# Altium schematic sheet STM32_GPIO.SchDoc
size A4
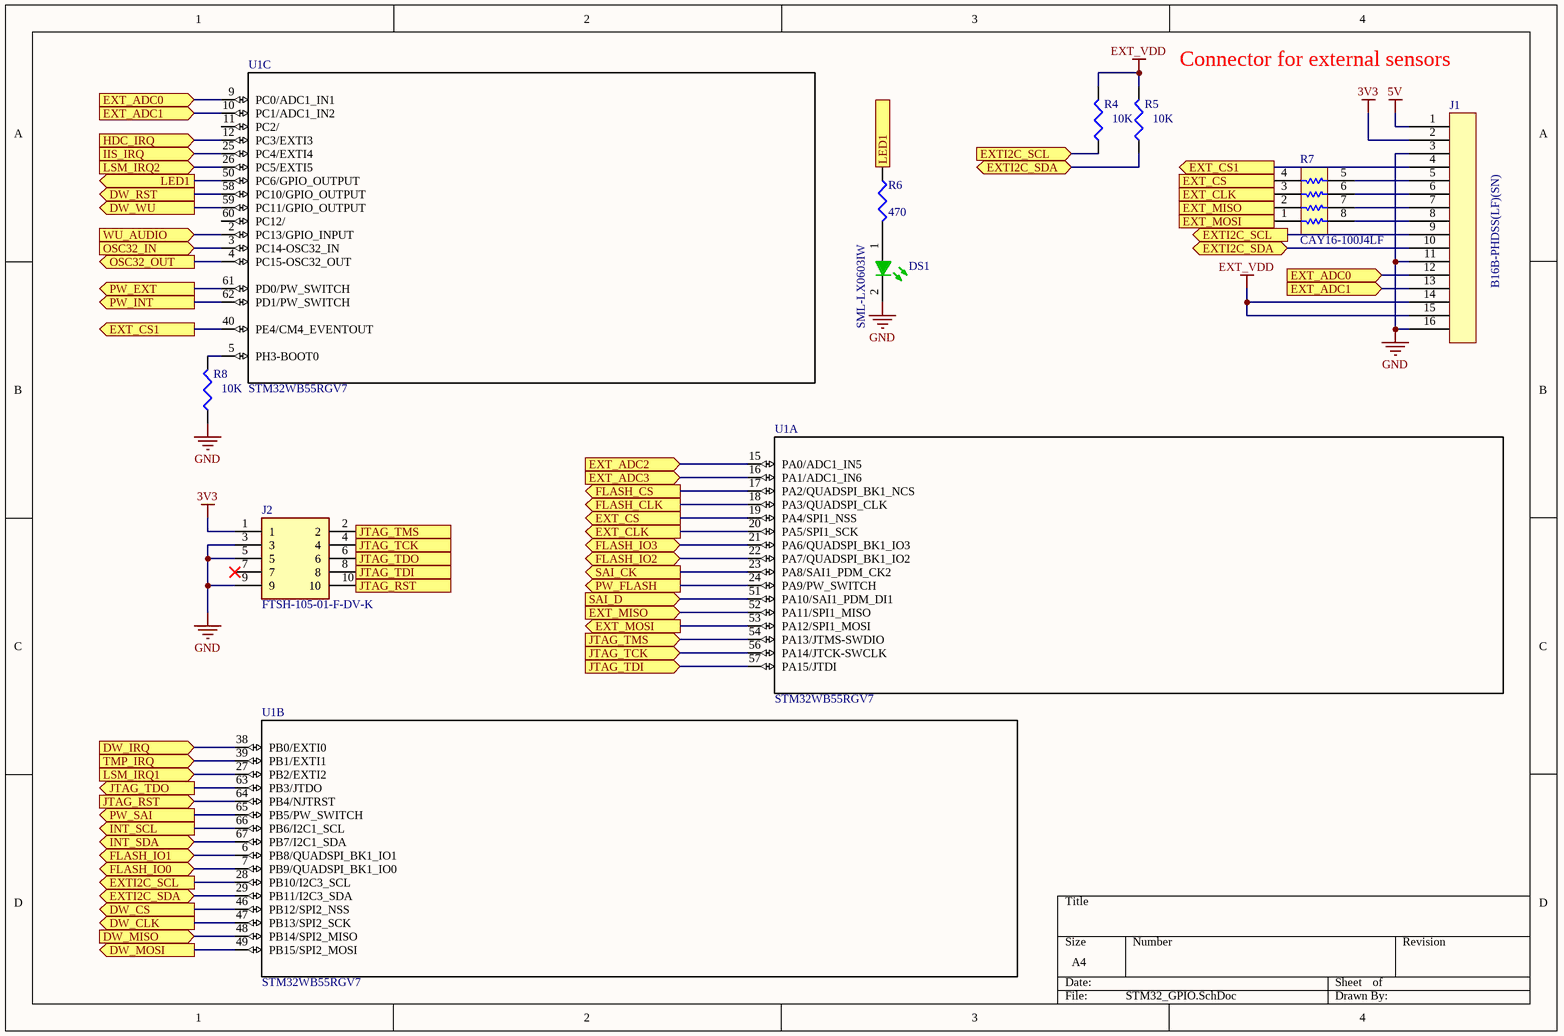
[diagram p0: STM32_GPIO.SchDoc]

## Parts
DS1  SML-LX0603IW  [KING-0603LED_GREEN_V]
J1  B16B-PHDSS(LF)(SN)  [B16B-PHDSS(LF)(SN) - duplicate]
J2  FTSH-105-01-F-DV-K  [SAMTEC_FTSH-105-01-L-DV]
R4  value 10K  [J1-0603]
R5  value 10K  [J1-0603]
R6  value 470  [J1-0603]
R7  CAY16-100J4LF  [BOUR-CAY16-J4_V]
R8  value 10K  [J1-0603]
U1  STM32WB55RGV7  [*QFN40P800X800X100-69N]  (parts A,B,C of 4)

## Ports
DW_CLK (out), DW_CS (out), DW_IRQ (in), DW_MISO (in), DW_MOSI (out), DW_RST (out), DW_WU (out), EXT_ADC0 (in), EXT_ADC1 (in), EXT_ADC2 (in), EXT_ADC3 (in), EXT_CLK (out), EXT_CS1 (out), EXT_CS (out), EXT_MISO (in), EXT_MOSI (out), EXTI2C_SCL (in), EXTI2C_SCL (out), EXTI2C_SDA (bidir), FLASH_CLK (out), FLASH_CS (out), FLASH_IO0 (bidir), FLASH_IO1 (bidir), FLASH_IO2 (bidir), FLASH_IO3 (bidir), HDC_IRQ (in), IIS_IRQ (in), INT_SCL (out), INT_SDA (bidir), JTAG_RST (in), JTAG_RST (out), JTAG_TCK (in), JTAG_TCK (out), JTAG_TDI (in), JTAG_TDI (out), JTAG_TDO (in), JTAG_TDO (out), JTAG_TMS (in), JTAG_TMS (out), LED1 (in), LED1 (out), LSM_IRQ1 (in), LSM_IRQ2 (in), OSC32_IN (in), OSC32_OUT (out), PW_EXT (out), PW_FLASH (out), PW_INT (out), PW_SAI (out), SAI_CK (out), SAI_D (in), TMP_IRQ (in), WU_AUDIO (in)

## Nets
3V3: J1.2 J2.1
5V: J1.1
EXT_VDD: J1.14 J1.15 R4.2 R5.2
GND: DS1.2(K) J1.3 J1.11 J1.16 J2.3 J2.5 J2.9 R8.1
DW_CLK: U1.47(PB13/SPI2_SCK) ; port DW_CLK
DW_CS: U1.46(PB12/SPI2_NSS) ; port DW_CS
DW_IRQ: U1.38(PB0/EXTI0) ; port DW_IRQ
DW_MISO: U1.48(PB14/SPI2_MISO) ; port DW_MISO
DW_MOSI: U1.49(PB15/SPI2_MOSI) ; port DW_MOSI
DW_RST: U1.58(PC10/GPIO_OUTPUT) ; port DW_RST
DW_WU: U1.59(PC11/GPIO_OUTPUT) ; port DW_WU
EXT_ADC0: J1.12 U1.9(PC0/ADC1_IN1) ; port EXT_ADC0
EXT_ADC1: J1.13 U1.10(PC1/ADC1_IN2) ; port EXT_ADC1
EXT_ADC2: U1.15(PA0/ADC1_IN5) ; port EXT_ADC2
EXT_ADC3: U1.16(PA1/ADC1_IN6) ; port EXT_ADC3
EXT_CLK: R7.3 U1.20(PA5/SPI1_SCK) ; port EXT_CLK
EXT_CS: R7.4 U1.19(PA4/SPI1_NSS) ; port EXT_CS
EXT_CS1: J1.4 U1.40(PE4/CM4_EVENTOUT) ; port EXT_CS1
EXT_MISO: R7.2 U1.52(PA11/SPI1_MISO) ; port EXT_MISO
EXT_MOSI: R7.1 U1.53(PA12/SPI1_MOSI) ; port EXT_MOSI
EXTI2C_SCL: J1.9 R4.1 U1.28(PB10/I2C3_SCL) ; port EXTI2C_SCL
EXTI2C_SDA: J1.10 R5.1 U1.29(PB11/I2C3_SDA) ; port EXTI2C_SDA
FLASH_CLK: U1.18(PA3/QUADSPI_CLK) ; port FLASH_CLK
FLASH_CS: U1.17(PA2/QUADSPI_BK1_NCS) ; port FLASH_CS
FLASH_IO0: U1.7(PB9/QUADSPI_BK1_IO0) ; port FLASH_IO0
FLASH_IO1: U1.6(PB8/QUADSPI_BK1_IO1) ; port FLASH_IO1
FLASH_IO2: U1.22(PA7/QUADSPI_BK1_IO2) ; port FLASH_IO2
FLASH_IO3: U1.21(PA6/QUADSPI_BK1_IO3) ; port FLASH_IO3
HDC_IRQ: U1.12(PC3/EXTI3) ; port HDC_IRQ
IIS_IRQ: U1.25(PC4/EXTI4) ; port IIS_IRQ
INT_SCL: U1.66(PB6/I2C1_SCL) ; port INT_SCL
INT_SDA: U1.67(PB7/I2C1_SDA) ; port INT_SDA
JTAG_RST: J2.10 U1.64(PB4/NJTRST) ; port JTAG_RST
JTAG_TCK: J2.4 U1.56(PA14/JTCK-SWCLK) ; port JTAG_TCK
JTAG_TDI: J2.8 U1.57(PA15/JTDI) ; port JTAG_TDI
JTAG_TDO: J2.6 U1.63(PB3/JTDO) ; port JTAG_TDO
JTAG_TMS: J2.2 U1.54(PA13/JTMS-SWDIO) ; port JTAG_TMS
LED1: R6.1 U1.50(PC6/GPIO_OUTPUT) ; port LED1
LSM_IRQ1: U1.27(PB2/EXTI2) ; port LSM_IRQ1
LSM_IRQ2: U1.26(PC5/EXTI5) ; port LSM_IRQ2
OSC32_IN: U1.3(PC14-OSC32_IN) ; port OSC32_IN
OSC32_OUT: U1.4(PC15-OSC32_OUT) ; port OSC32_OUT
PW_EXT: U1.61(PD0/PW_SWITCH) ; port PW_EXT
PW_FLASH: U1.24(PA9/PW_SWITCH) ; port PW_FLASH
PW_INT: U1.62(PD1/PW_SWITCH) ; port PW_INT
PW_SAI: U1.65(PB5/PW_SWITCH) ; port PW_SAI
SAI_CK: U1.23(PA8/SAI1_PDM_CK2) ; port SAI_CK
SAI_D: U1.51(PA10/SAI1_PDM_DI1) ; port SAI_D
TMP_IRQ: U1.39(PB1/EXTI1) ; port TMP_IRQ
WU_AUDIO: U1.2(PC13/GPIO_INPUT) ; port WU_AUDIO
NetDS1_1: DS1.1(A) R6.2
NetJ1_5: J1.5 R7.5
NetJ1_6: J1.6 R7.6
NetJ1_7: J1.7 R7.7
NetJ1_8: J1.8 R7.8
NetR8_2: R8.2 U1.5(PH3-BOOT0)

Not connected (* = marked no-connect by the designer): J2 7*; U1 11(PC2/) 60(PC12/)

## Notes on the sheet
- Connector for external sensors

## Library data of the parts
DS1 = CMP-0404-00001-1: LED, SMT, 0603(1608), 1.1mm thickness, Green; Manufacturer: Kingbright; PartNumber: KP-1608MGC; Reverse Voltage: 5 V; Power Dissipation: 75 mW; Forward Current: 30 mA; Packing Type: 2000 pcs / reel; Mounting Technology: Surface Mount; Storage Temperature: -40 to +85 degC; ComponentLink1URL: http://www.kingbright.com/; PackageDescription: 2-Pin SMT LED, 1.6 x 0.8 mm Pitch; PackageReference: 0603LED_GREEN; ComponentLink1Description: Manufacturer URL
J1 = B16B-PHDSS(LF)(SN): CONN HEADER VERT 16POS 2MM; ComponentLink1Description: Digikey; ComponentLink1URL: https://www.digikey.com/products/en?keywords=B16B-PHDSS(LF)(SN)
J2 = FTSH-105-01-F-DV-K: Connector; Manufacturer_Name: SAMTEC; Datasheet Link: http://suddendocs.samtec.com/prints/ftsh-1xx-xx-xxx-dv-xxx-xxx-mkt.pdf; Manufacturer_Part_Number: FTSH-105-01-F-DV-K; Mouser Part Number: 200-FTSH10501FDVK; Mouser Price/Stock: https://www.mouser.com/Search/Refine.aspx?Keyword=200-FTSH10501FDVK; RS Part Number: 1592372; RS Price/Stock: http://uk.rs-online.com/web/p/products/1592372
R4-R6 R8 = Res3: Resistor; Published: 8-Jun-2000; LatestRevisionDate: 29-May-2009; LatestRevisionNote: IPC-7351 Footprint Added.; PackageReference: J1-0603; Publisher: Altium Limited; PackageDescription: Chip Resistor
R7 = CMP-1747-00007-1: Chip Resistor Array, 1 KOhm, +/- 5%, 62.5 mW, -55 to 125 degC, 8-Pin SMD, RoHS, Tape and Reel; Power Rating: 100 mW; Tolerance: 1%; Voltage Rating (DC): 50 V; Resistance: 330 Ohm; Case\Package: 0603; RoHSCompliant: true; Case Code (Metric): 1608; Pins: 2; PackageDescription: 8-Pin Surface Mount Device, Body 1.6 x 3.2 mm, Pitch 0.8 mm; Height: 0.45 mm; Min Operating Temperature: -55 degC; ComponentLink1URL: http://www.bourns.com/; Case Code (Imperial): 0603; Packaging: Tape and Reel; PackageReference: CAY16-J4; ComponentLink1Description: Manufacturer URL; ComponentLink2Description: Datasheet; Length: 1.6 mm; Width: 0.8 mm; Max Operating Temperature: 155 degC; Mount: Surface Mount; DatasheetVersion: Sep-14; Voltage Rating: 50 V; REACH SVHC: No SVHC; ComponentLink2URL: http://www.bourns.com/pdfs/CATCAY.pdf; Package Quantity: 5000
U1 = STM32WB55RGV7: Multiprotocol wireless 32-bit MCU Arm-based Cortex-M4; MF: STMicroelectronics; MP: STM32WB55RGV7; Price: None; Package: None; Availability: Unavailable; SnapEDA_Link: https://www.snapeda.com/parts/STM32WB55RGV7/STMicroelectronics/view-part/?ref=snap; Value: *